# EAGLE design SensorBoard (EAGLE 7.3.0)
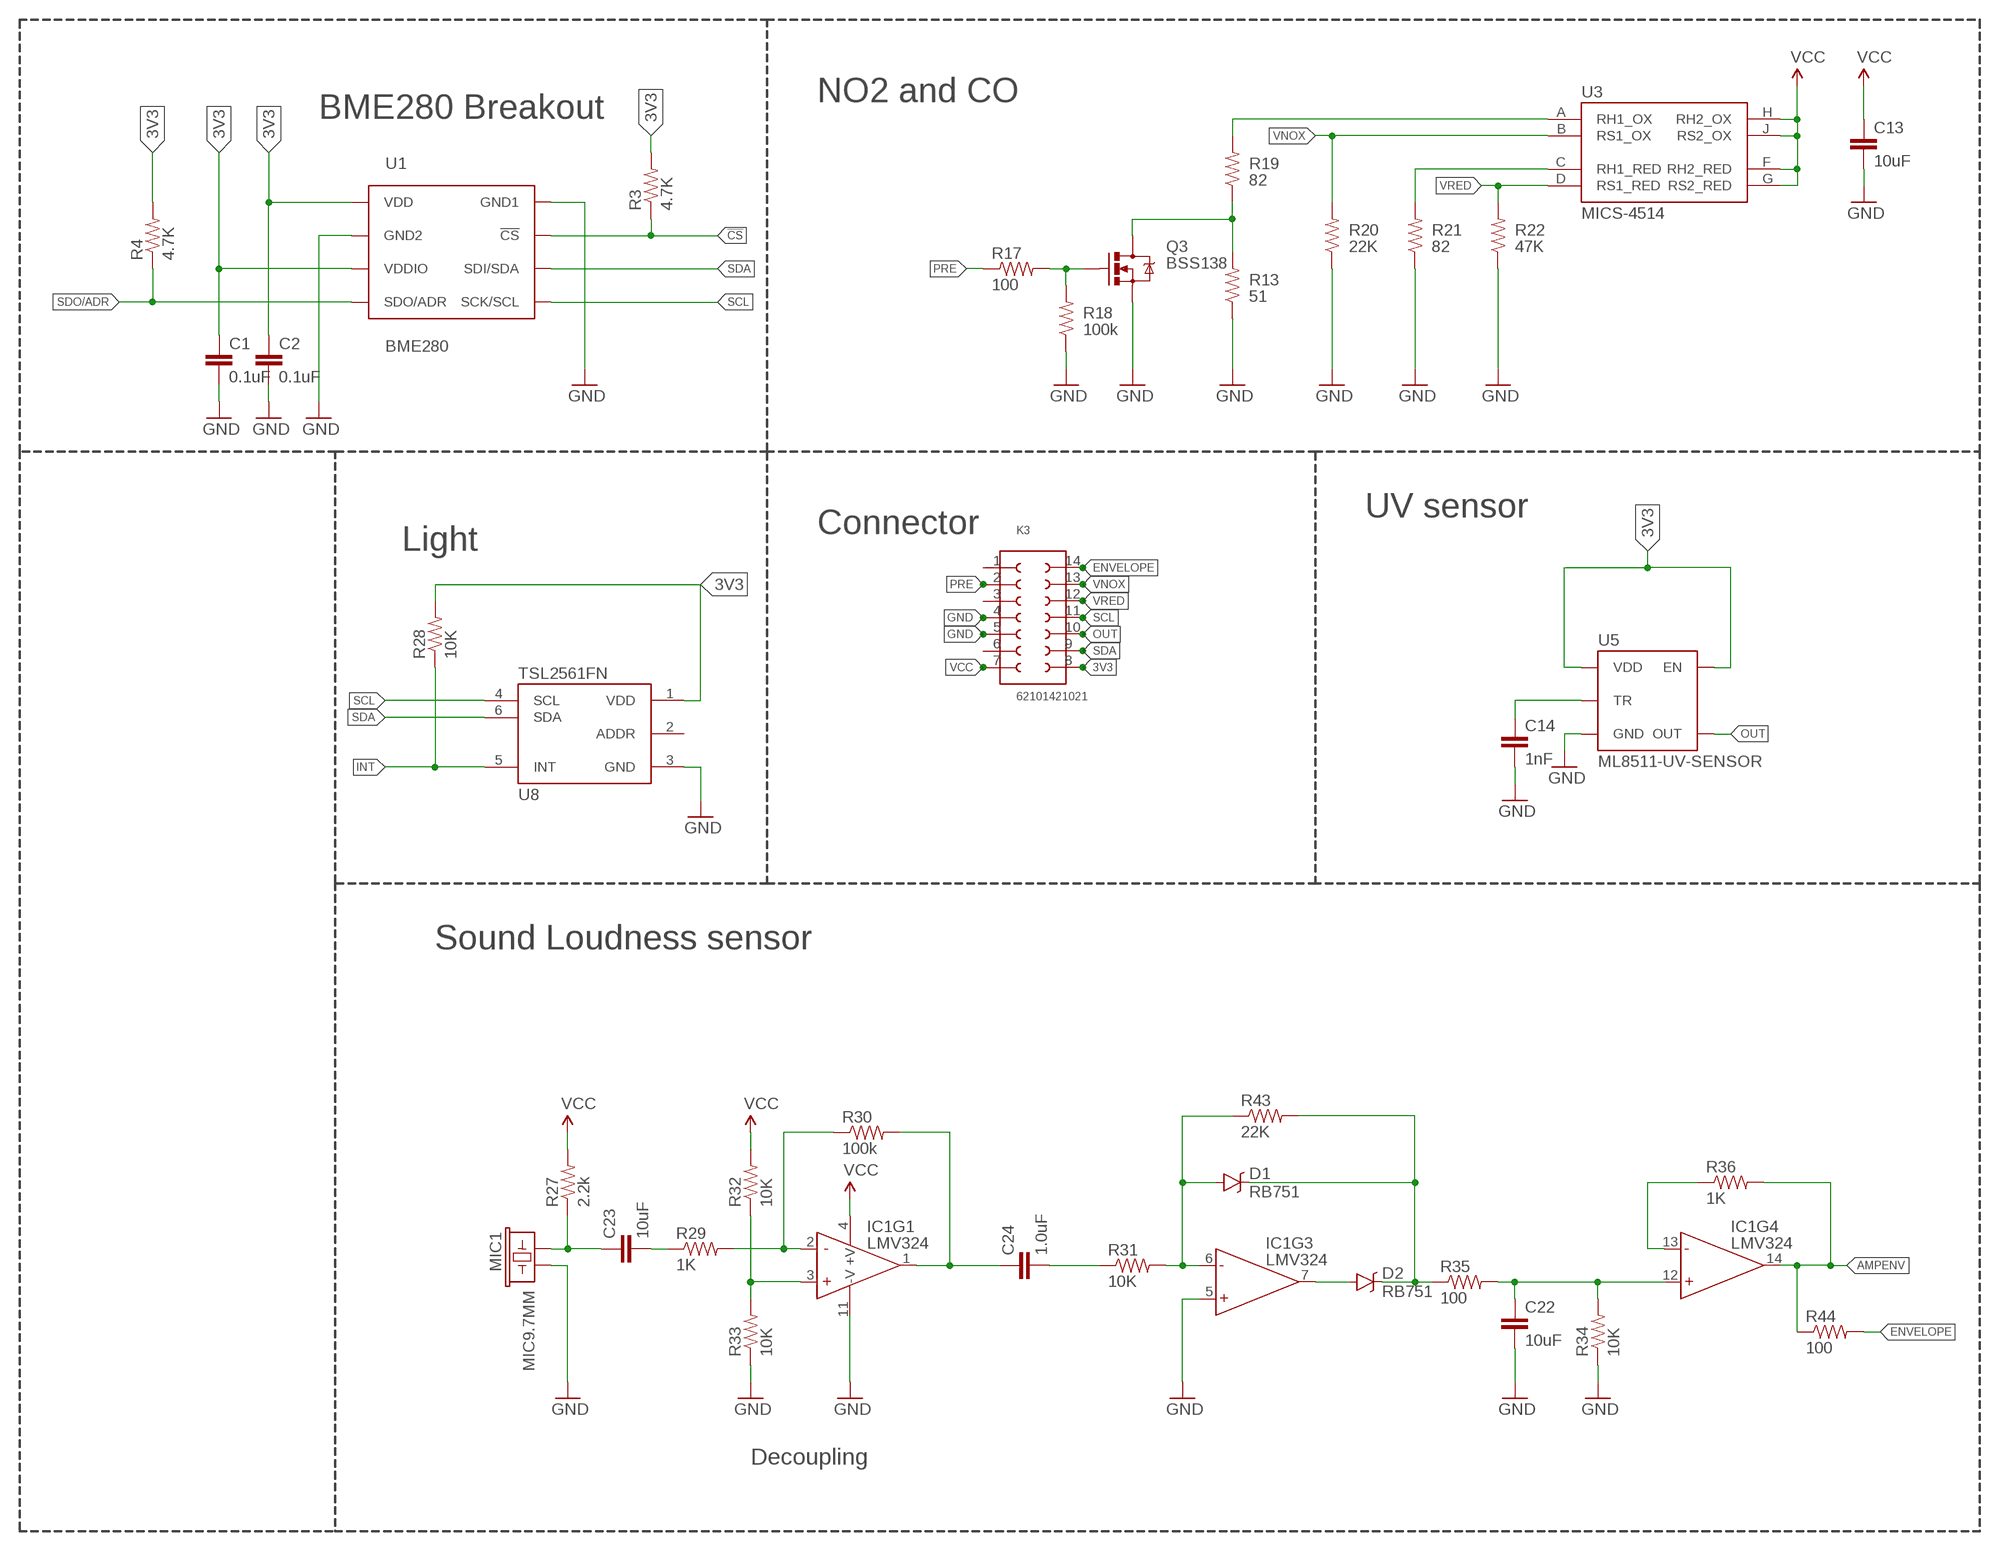
[diagram p0: schematic, sheet 1]

## Parts
C1  0.1uF  0.1UF-25V-5%(0603)  [0603-CAP]
C2  0.1uF  0.1UF-25V-5%(0603)  [0603-CAP]
C13  10uF  CAP0805  [0805]
C14  1nF  1NF/1000PF-50V-10%(0603)  [0603-CAP]
C22  10uF  10UF-6.3V-20%(1206)  [1206]
C23  10uF  10UF-6.3V-20%(1206)  [1206]
C24  1.0uF  1.0UF-16V-10%(0603)  [0603-CAP]
D1  RB751  [SOD-523]
D2  RB751  [SOD-523]
IC1  LMV324  [SO014]
K3  62101421021  [62101421021]
MIC1  MIC9.7MM  [MIC-9.7MM]
Q3  MOSFET-NCHANNELBSS138  [SOT23-3]
R3  4.7K  4.7KOHM-1/10W-1%(0603)  [0603-RES]
R4  4.7K  4.7KOHM-1/10W-1%(0603)  [0603-RES]
R13  51  RESISTOR0603  [0603-RES]
R17  100  100OHM1/10W1%(0603)  [0603-RES]
R18  100k  100KOHM1/10W1%(0603)  [0603-RES]
R19  82  RESISTOR0805-RES  [0805]
R20  22K  22KOHM1/10W1%(0603)  [0603-RES]
R21  82  RESISTOR0805-RES  [0805]
R22  47K  47KOHM1/10W1%(0603)  [0603-RES]
R27  2.2k  2.2KOHM1/10W1%(0603)  [0603-RES]
R28  10K  RESISTOR0603  [0603-RES]
R29  1K  1KOHM1/10W1%(0603)  [0603-RES]
R30  100k  100KOHM1/10W1%(0603)  [0603-RES]
R31  10K  10KOHM1/10W1%(0603)0603  [0603-RES]
R32  10K  10KOHM1/10W1%(0603)0603  [0603-RES]
R33  10K  10KOHM1/10W1%(0603)0603  [0603-RES]
R34  10K  10KOHM1/10W1%(0603)0603  [0603-RES]
R35  100  100OHM1/10W1%(0603)  [0603-RES]
R36  1K  1KOHM1/10W1%(0603)  [0603-RES]
R43  22K  22KOHM1/10W1%(0603)  [0603-RES]
R44  100  100OHM1/10W1%(0603)  [0603-RES]
U1  BME280  [BME280_LGA]
U3  MICS-4514  [MICS_10-SMD]
U5  ML8511-UV-SENSOR  ML8511-UV-SENSORSMD  [ML8511]
U8  TSL2561FN  [FN-6]

## Nets
3V3: C1.1 C2.1 C13.1 K3.8 R3.2 R4.2 R28.2 U1.P$6(VDDIO) U1.P$8(VDD) U3.F(RH2_RED) U3.G(RS2_RED) U3.H(RH2_OX) U3.J(RS2_OX) U5.4(EN) U5.7(VDD) U8.1(VDD) ; supply symbol labelled VCC
!CS: R3.1 U1.P$2(!CS)
AMPENV: IC1.14(OUT) R36.2 R44.1
ENVELOPE: K3.14 R44.2
GND: C1.2 C2.2 C13.2 C14.2 C22.2 IC1.5(+IN) IC1.11(-V) K3.4 K3.5 MIC1.2 Q3.2(S) R13.1 R18.1 R20.1 R21.1 R22.1 R33.1 R34.1 U1.P$1(GND1) U1.P$7(GND2) U5.5(GND) U8.3(GND)
INT: R28.1 U8.5(INT)
N$: C24.1 IC1.1(OUT) R30.2
N$7: Q3.3(D) R13.2 R19.1
N$13: Q3.1(G) R17.2 R18.2
N$15: R19.2 U3.A(RH1_OX)
N$16: R21.2 U3.C(RH1_RED)
N$17: C14.1 U5.10(TR)
N$19: C23.1 MIC1.1 R27.1
N$20: IC1.3(+IN) R32.1 R33.2
N$21: IC1.2(-IN) R29.2 R30.1
N$22: C23.2 R29.1
N$23: C24.2 R31.1
N$24: D1.A IC1.6(-IN) R31.2 R43.1
N$25: D2.A IC1.7(OUT)
N$26: D1.C D2.C R35.1 R43.2
N$27: C22.1 IC1.12(+IN) R34.2 R35.2
N$28: IC1.13(-IN) R36.1
OUT: K3.10 U5.8(OUT)
PRE: K3.2 R17.1
SCL: K3.11 U1.P$4(SCK/SCL) U8.4(SCL)
SDA: K3.9 U1.P$3(SDI/SDA) U8.6(SDA)
SDO/ADR: R4.1 U1.P$5(SDO/ADR)
VCC: IC1.4(+V) K3.7 R27.2 R32.2
VNOX: K3.13 R20.2 U3.B(RS1_OX)
VRED: K3.12 R22.2 U3.D(RS1_RED)
Unconnected: IC1.8(OUT) IC1.9(-IN) IC1.10(+IN) K3.1 K3.3 K3.6 U8.2(ADDR)

## Notes on the sheet
- NO2 and CO
- BME280 Breakout
- UV sensor
- Connector
- Light
- Sound Loudness sensor
- Decoupling

## Library data of the parts
C1 C2 = SparkFun-Capacitors:0.1UF-25V-5%(0603): CAP-08604; PROD_ID: CAP-08604
C13 = SparkFun-Capacitors:CAP: Capacitor Standard 0603 ceramic capacitor, and 0.1" leaded capacitor.; PROD_ID: CAP-11330
C14 = SparkFun-Capacitors:1NF/1000PF-50V-10%(0603): CAP-07886; PROD_ID: CAP-07886
C22 C23 = SparkFun-Capacitors:10UF-6.3V-20%(1206): Ceramic CAP-10057; PROD_ID: CAP-10057
C24 = SparkFun-Capacitors:1.0UF-16V-10%(0603): CAP-00868; PROD_ID: CAP-00868
D1 D2 = SparkFun-DiscreteSemi:RB751: 40V 120mA SOD-523 Schottky DIO-11018; PROD_ID: DIO-11018
IC1 = SparkFun-AnalogIC:LMV324: Jellybean quad op-amp; PROD_ID: IC-08227
K3 = Eagle_BOARD-TO-BOARD_CONNECTORS_rev15d:62101421021: WR-PHD 1.27mm Dual SMT Pin Header H=3.80 mm, 14 Pins=>Code : Con_BTB_PHD_1.27_2_62101421021 <http://katalog.we-online.de/media/thumbs2/eican/thb_Con_BTB_PHD_1.27_2_6210xx21021_pf2.jpg> Details see: http://katalog.we-online.de/en/em/621_0xx_210_21 Created 2014-06-03, Karrer Zheng 2014 (C) Würth Elektronik
MIC1 = SparkFun-Sensors:MIC: Omni-directional electret microphone. 9.7mm standard diameter.; PROD_ID: COMP-08856
Q3 = SparkFun-DiscreteSemi:MOSFET-NCHANNEL: Common NMOSFET Parts MFG P/N Store ID Prod ID FDD8780 TRANS-09984 SI7820DN TRANS-11055 FDS6630A IC-08089 2N7002PW TRANS-11151 FQP30N06L COM-10213 TRANS-10060 BSS123LT1G TRANS-08345 BSS138 TRANS-00830 BS170 2N7000; PROD_ID: TRANS-00830; P_NAME: BSS138
R3 R4 = SparkFun-Resistors:4.7KOHM-1/10W-1%(0603): RES-07857; PROD_ID: RES-07857
R13 = SparkFun-Resistors:RESISTOR: Resistor Basic schematic elements and footprints for 0603, 1206, and PTH resistors.; PROD_ID: RES-12314
R17 R35 R44 = SparkFun-Resistors:100OHM1/10W1%(0603): RES-07863; PROD_ID: RES-07863
R18 R30 = SparkFun-Resistors:100KOHM1/10W1%(0603): RES-07828; PROD_ID: RES-07828
R19 R21 = SparkFun-Resistors:RESISTOR: Resistor Basic schematic elements and footprints for 0603, 1206, and PTH resistors.; DK_ID: 541-82.0CCT-ND
R20 R43 = SparkFun-Resistors:22KOHM1/10W1%(0603): RES-07853; PROD_ID: RES-07853
R22 = SparkFun-Resistors:47KOHM1/10W1%(0603): RES-07871; PROD_ID: RES-07871
R27 = SparkFun-Resistors:2.2KOHM1/10W1%(0603): RES-08272; PROD_ID: RES-08272
R28 = SparkFun-Resistors:RESISTOR: Resistor Basic schematic elements and footprints for 0603, 1206, and PTH resistors.
R29 R36 = SparkFun-Resistors:1KOHM1/10W1%(0603): RES-07856; PROD_ID: RES-07856
R31-R34 = SparkFun-Resistors:10KOHM1/10W1%(0603): RES-00824; PROD_ID: RES-00824
U1 = BME280ComponentLibrary:BME280; PROD_ID: IC-13090
U3 = SparkFun-Sensors:MICS-4514: Metal oxide MEMS carbon monoxide (CO) and NOx sensor in an SMD package.; PROD_ID: COMP-12310
U5 = ML8511:ML8511-UV-SENSOR
U8 = mike-temp:TSL2561: TSL2561 illumination sensor Approximates Human Eye Response Precisely Measures Illuminance Programmable Interrupt Function with User-Defined Upper and Lower Threshold 400 KHz I2C interface Programmable Analog Gain and Integration Time Supporting 1,000,000-to-1 Dynamic Range Automatically Rejects 50/60-Hz Lighting Ripple Low Active Power (0.75 mW Typical) with Power Down Mode RoHS Compliant The TSL2561 is a light-to-digital converter that transform light intensity to a digital signal output via I2C interface. The device combines one broadband photodiode (visible plus infrared) and one infrared-responding photodiode on a single CMOS integrated circuit capable of providing a near-photopic response over an effective 20-bit dynamic range (16-bit resolution). Two integrating ADCs convert the photodiode currents to a digital output that represents the irradiance measured on each channel. This digital output can be input to a microprocessor where illuminance (ambient light level) in lux is derived using an empirical formula to approximate the human eye response. The TSL2561 device supports a traditional level style interrupt that remains asserted until the firmware clears it.

## Board
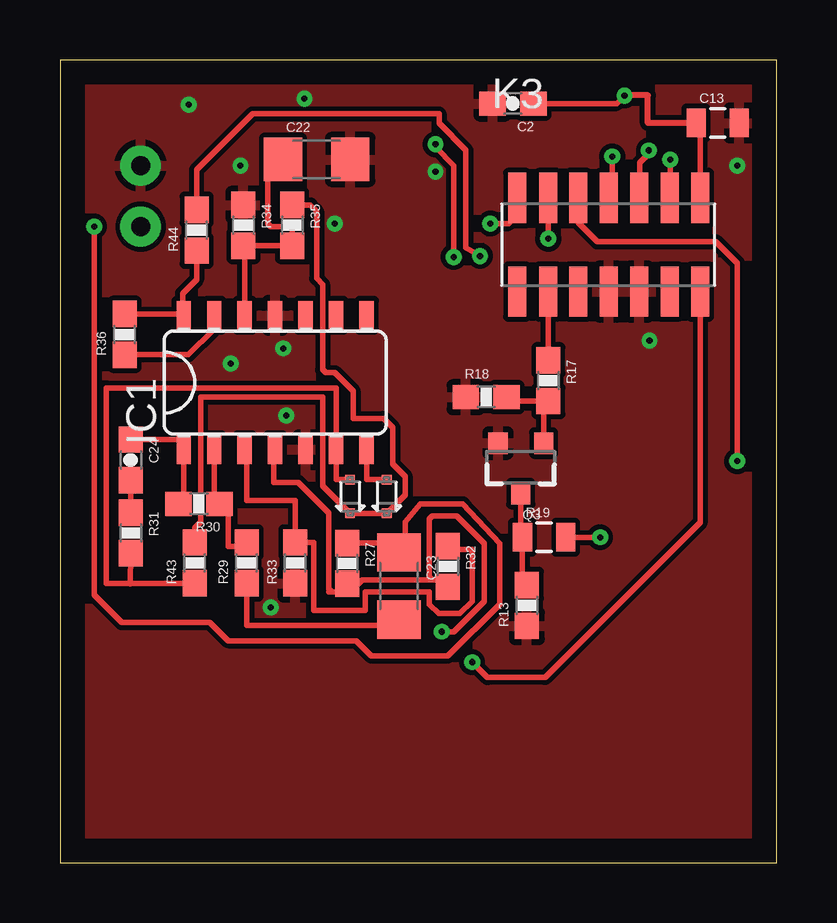
[diagram p1: board, top side]
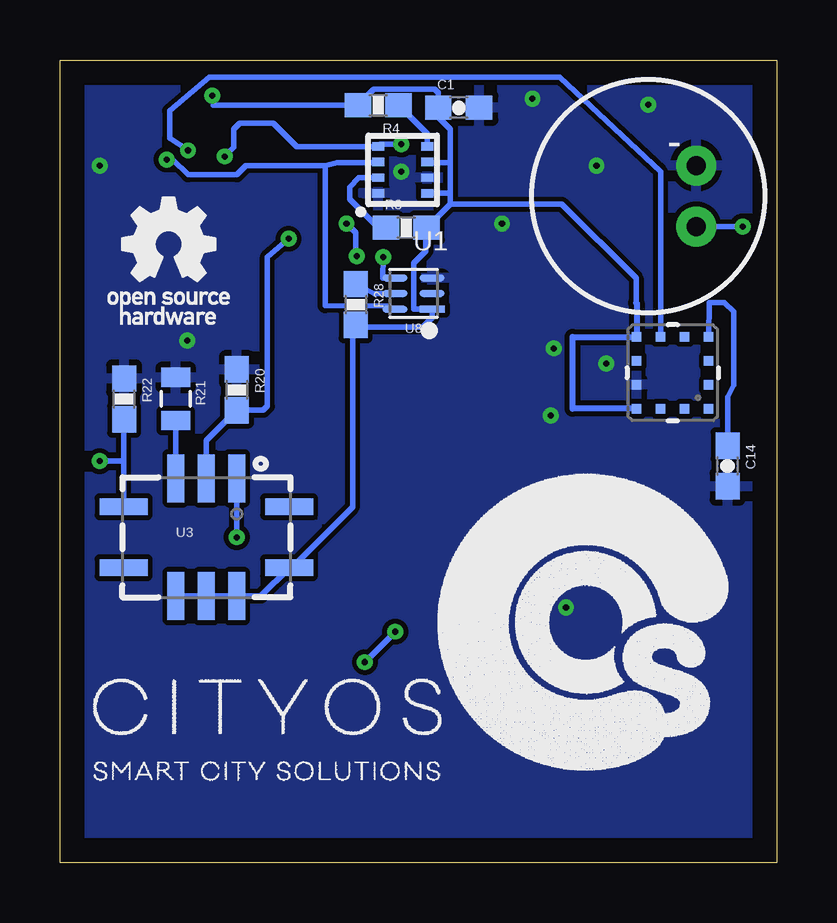
[diagram p2: board, bottom side, seen from below]

Size 29.87 x 33.46 mm. Coordinates in mm from the lower left corner, seen from the top.
Outline: 0,33.47 0,0 29.87,0 29.87,33.47 0,33.47
Copper layers (1*16): Top 0.035mm / dielectric 1.5mm / Bottom 0.035mm
Design rules "default": minimum track width 10mil, minimum drill 24mil, track to track 8mil, track to pad 8mil, pad to pad 8mil, via to via 8mil, smd to smd 8mil, copper to edge 40mil, drill to drill 8mil, minimum pad ring 10mil, minimum via ring 8mil, stop-mask expansion 4mil, vias tented up to drill 0mil, thermal gap 10mil

### Footprints (pad centres in the part's own frame; a part is rotated, then mirrored left to right if it is on the bottom)
0603-CAP = smd 1.1 x 1: 1 -0.85,0; 2 0.85,0
0805 = smd 0.8 x 1.2: 1 -0.9,0; 2 0.9,0
1206 = smd 1.6 x 1.8: 1 -1.4,0; 2 1.4,0
SOD-523 = smd 0.4 x 0.4: A -0.7,0; C 0.7,0
SO014 = smd 0.6 x 1.2: 1 -3.175,-2.8; 2 -1.905,-2.8; 3 -0.635,-2.8; 4 0.635,-2.8; 5 1.905,-2.8; 6 3.175,-2.8; 7 4.445,-2.8; 8 4.445,2.8; 9 3.175,2.8; 10 1.905,2.8; 11 0.635,2.8; 12 -0.635,2.8; 13 -1.905,2.8; 14 -3.175,2.8
62101421021 = smd 0.75 x 2.1: 1 -4.445,-1.95; 2 -3.157,-1.95; 3 -1.905,-1.95; 4 -0.635,-1.95; 5 0.635,-1.95; 6 1.905,-1.95; 7 3.175,-1.95; 8 3.175,1.95; 9 1.905,1.95; 10 0.635,1.95; 11 -0.635,1.95; 12 -1.905,1.95; 13 -3.157,1.95; 14 -4.445,1.95
MIC-9.7MM = drill 0.8 pad 1.676: 1 -2,1.27; 2 -2,-1.27
SOT23-3 = smd 0.8 x 0.9: 1 -0.95,-1; 2 0.95,-1; 3 0,1.1
0603-RES = smd 1.1 x 1: 1 -0.85,0; 2 0.85,0
BME280_LGA = smd 0.5 x 0.35: P$1 1.025,0.975; P$2 1.025,0.325; P$3 1.025,-0.325; P$4 1.025,-0.975; P$5 -1.025,-0.975; P$6 -1.025,-0.325; P$7 -1.025,0.325; P$8 -1.025,0.975
MICS_10-SMD = smd 0.7 x 2: A 1.27,2.45; B 0,2.45; C -1.27,2.45; F -1.27,-2.45; G 0,-2.45; H 1.27,-2.45 | smd 2 x 0.7: D -3.45,1.27; E -3.45,-1.27; J 3.45,-1.27; K 3.45,1.27
ML8511 = smd 0.4 x 0.4: 1 -1.5,-1.5; 2 -1.5,-0.5; 3 -1.5,0.5; 4 -1.5,1.5; 5 -0.5,1.5; 6 0.5,1.5; 7 1.5,1.5; 8 1.5,0.5; 9 1.5,-0.5; 10 1.5,-1.5; 11 0.5,-1.5; 12 -0.5,-1.5
FN-6 = smd 1.05 x 0.3: 1 -0.775,0.65; 2 -0.775,0; 3 -0.775,-0.65; 4 0.775,-0.65; 5 0.775,0; 6 0.775,0.65

### Placement (x,y rotation side)
C1  13.26,31.47 0 bottom
C2  18.87,31.65 180 top
C13  27.41,30.84 0 top
C14  2.06,16.54 270 bottom
C22  10.69,29.31 0 top
C23  14.12,11.53 270 top
C24  2.95,16.79 270 top
D1  12.09,15.27 270 top
D2  13.61,15.27 270 top
IC1  8.33,20.02 0 top
K3  23.49,25.76 0 top
MIC1  5.36,27.79 180 bottom
Q3  19.2,16.49 180 top
R3  15.44,26.47 0 bottom
R4  16.61,31.58 180 bottom
R13  19.46,10.72 90 top
R17  20.34,20.09 270 top
R18  17.75,19.41 0 top
R19  20.17,13.57 0 top
R20  22.5,19.71 270 bottom
R21  25.04,19.33 270 bottom
R22  27.2,19.33 270 bottom
R27  11.96,12.47 270 top
R28  17.55,23.27 270 bottom
R29  7.77,12.5 90 top
R30  5.79,14.96 180 top
R31  2.95,13.74 270 top
R32  16.15,12.35 270 top
R33  9.8,12.5 90 top
R34  7.65,26.57 270 top
R35  9.68,26.57 270 top
R36  2.69,22.02 90 top
R43  5.61,12.5 90 top
R44  5.69,26.37 90 top
U1  15.6,28.88 180 bottom
U3  23.77,13.57 0 bottom
U5  4.34,20.42 90 bottom
U8  15.14,23.73 180 bottom

### Tracks (layer width: path | path; a pad name or v marks a point on that pad's centre or on a via)
3V3  (via drill 0.25)
  Top 0.229: K3.8 26.67,30.68 C13.1 | C2.1 23.19,31.65 v23.52,31.98
  Top 0.254: C13.1 24.5,30.84 24.5,31.99 v23.52,31.99 v23.52,31.98
  Bottom 0.229: 13.61,29.19 13.61,30.59 14.11,31.08 C1.1 14.11,32.09 14.25,32.24 16.8,32.24 R4.2 23.49,31.57 v23.52,31.98 | U1.P$6 14.55,29.19 13.61,29.19 | 13.61,29.19 13.61,27.92 | 13.61,27.92 13.61,27.45 | 13.61,27.45 R3.2 14.63,26.43 14.63,25.5 15.14,25 15.14,23.09 15.12,23.08 U8.1 14.36,22.72 14.76,22.33 17.08,22.33 R28.2 17.68,22.29 17.68,14.84 20.22,12.3 U3.J 21.5,11.12 U3.H U3.G U3.F | U1.P$8 13.62,27.91 13.61,27.92 | 13.61,27.45 8.95,27.45 5.87,24.36 5.87,23.35
  Bottom 0.254: 5.87,23.35 5.84,23.35 U5.7 8.51,21.92 8.51,18.93 U5.4
!CS
  Bottom 0.229: R3.1 16.61,26.47 17.81,27.66 17.81,28.17 17.42,28.55 U1.P$2
AMPENV
  Top 0.229: R36.2 5.1,22.88 IC1.14 5.11,22.87 5.11,23.73 5.69,24.31 R44.1
ENVELOPE  (via drill 0.25)
  Top 0.229: R44.2 5.69,28.88 8.03,31.22 15.79,31.22 15.79,30.82 16.92,29.7 16.92,25.63 v17.5,25.29 | K3.14 19.08,27.68 19.08,27.03 18.69,26.65 v17.93,26.65
  Bottom 0.229: v17.5,25.29 17.55,25.38 17.55,26.27 v17.93,26.65
GND  (via drill 0.25)
  other vias: 9.42,18.65 8.79,10.65 9.3,21.44 15.65,28.81 10.19,31.85 7.52,29.06 11.46,26.65 28.22,29.06 5.36,31.6 24.56,21.77 7.11,20.8
  pour Top: -8.38,37.44 34.54,37.44 34.54,-4.44 -8.36,-4.44
  pour Bottom: -4.04,34.65 32.41,34.65 32.41,-2.44 -4.04,-2.44
INT
  Bottom 0.229: U8.5 16.78,23.73 R28.1
N$
  Top 0.229: C24.1 5.16,17.64 IC1.1 5.16,14.96 R30.2
N$7
  Top 0.229: Q3.3 19.2,13.63 R19.1 19.27,11.76 R13.2
N$13
  Top 0.229: Q3.1 20.15,19.05 R17.2 18.77,19.24 R18.2
N$15  (via drill 0.25)
  Top 0.229: R19.2 v22.5,13.57
  Bottom 0.229: v22.5,13.57 U3.A
N$16
  Bottom 0.229: U3.C R21.2
N$17
  Bottom 0.229: C14.1 2.06,19.41 1.8,19.92 1.8,22.96 2.18,23.35 2.82,23.35 U5.10
N$19  (via drill 0.25)
  Top 0.229: R27.1 13.87,13.32 C23.1 14.38,13.19 14.38,14.2 15.01,14.96 16.79,14.96 18.31,13.31 18.31,10.77 16.15,8.61 12.98,8.61 12.34,9.25 7.01,9.25 6.25,10.01 2.57,10.01 1.42,11.15 v1.42,26.52
  Bottom 0.229: MIC1.1 v1.42,26.52
N$20
  Top 0.229: IC1.3 7.77,17.22 7.77,15.09 9.8,15.09 R33.2 10.57,13.35 10.57,10.52 12.73,10.52 12.73,11.28 15.39,11.28 15.39,10.77 15.77,10.39 16.66,10.39 17.17,10.9 17.17,13.06 16.29,13.06 R32.1 16.15,13.19
N$21
  Top 0.229: IC1.2 6.43,14.96 R30.1 7.01,14.96 7.01,13.19 7.77,13.19 R29.2
N$22
  Top 0.229: R29.1 7.77,9.88 13.87,9.88 C23.2
N$23
  Top 0.229: C24.2 R31.1
N$24
  Top 0.229: R31.2 2.93,11.62 R43.1 1.93,11.65 1.93,19.79 11.51,19.79 IC1.6 11.51,15.97 D1.A
N$25
  Top 0.229: D2.A 12.78,15.97 IC1.7
N$26
  Top 0.229: R35.1 10.43,27.42 10.69,27.16 10.69,24.36 10.95,24.11 10.95,20.55 11.07,20.43 11.46,20.43 12.22,19.66 12.22,18.52 13.49,18.52 13.87,18.14 13.87,16.61 14.38,16.11 14.38,15.33 D2.C D1.C 10.95,15.71 10.95,19.41 5.87,19.41 5.87,14.2 5.61,13.95 R43.2
N$27
  Top 0.229: IC1.12 7.7,25.67 R34.2 R35.2 9.68,26.52 8.79,26.52 8.66,26.65 8.66,28.68 C22.1
N$28
  Top 0.229: R36.1 5.35,21.18 6.38,22.2 6.38,22.77 IC1.13
OUT  (via drill 0.25)
  Top 0.229: v24.54,29.7 24.54,29.57 24.16,29.19 24.16,27.73 K3.10
  Bottom 0.229: U5.8 4.84,28.8 9.04,32.74 23.65,32.74 25.3,31.35 25.3,30.2 v24.54,29.7
PRE
  Top 0.229: R17.1 20.35,23.8 K3.2
SCL  (via drill 0.25)
  Top 0.229: v23.01,29.44 23.01,27.86 K3.11 | v16.41,25.25 16.41,29.06 15.65,29.82 v15.65,29.95
  Bottom 0.229: v23.01,29.44 22.63,29.82 22.63,30.59 22.38,30.84 20.98,30.84 20,29.86 U1.P$4 16.53,29.95 v15.65,29.95 | U8.4 16.42,24.38 v16.41,25.25
SDA  (via drill 0.25)
  Top 0.229: v25.43,29.32 25.43,27.73 K3.9
  Bottom 0.229: U8.6 16.27,23.2 18.82,23.22 18.82,29.06 | 18.82,29.06 18.31,29.19 16.64,29.19 U1.P$3 | 18.82,29.06 22.12,29.06 22.5,28.68 24.54,28.68 25.17,29.32 v25.43,29.32
SDO/ADR
  Bottom 0.229: U1.P$5 14.57,30.38 R4.1
VCC  (via drill 0.25)
  Top 0.229: IC1.4 8.92,17.22 8.92,15.85 9.93,15.85 11.2,14.58 11.2,11.41 11.33,11.28 | 11.2,11.28 11.33,11.28 | 11.33,11.28 11.84,11.28 R27.2 12.43,11.62 12.6,11.79 15.52,11.79 | 15.52,11.79 15.86,11.79 R32.2 | K3.7 26.67,14.18 20.22,7.73 17.81,7.73 v17.17,8.36 | v15.9,9.63 16.41,9.63 17.68,10.9 17.68,13.31 16.54,14.46 15.52,14.46 15.39,14.33 15.39,11.92 15.52,11.79
  Bottom 0.229: v17.17,8.36 v15.9,9.63
VNOX  (via drill 0.25)
  Top 0.229: v20.35,26.01 K3.13
  Bottom 0.229: U3.B 23.77,17.59 R20.2 21.4,18.86 21.23,19.03 21.23,25.25 v20.35,26.01
VRED  (via drill 0.25)
  Top 0.229: K3.12 21.59,26.67 22.38,25.89 27.33,25.89 28.22,25 v28.22,16.74
  Bottom 0.229: U3.D 27.22,16.74 | 27.22,16.74 27.22,18.46 R22.2 | v28.22,16.74 27.22,16.74